# Altium schematic sheet peripherals.SchDoc
size A4
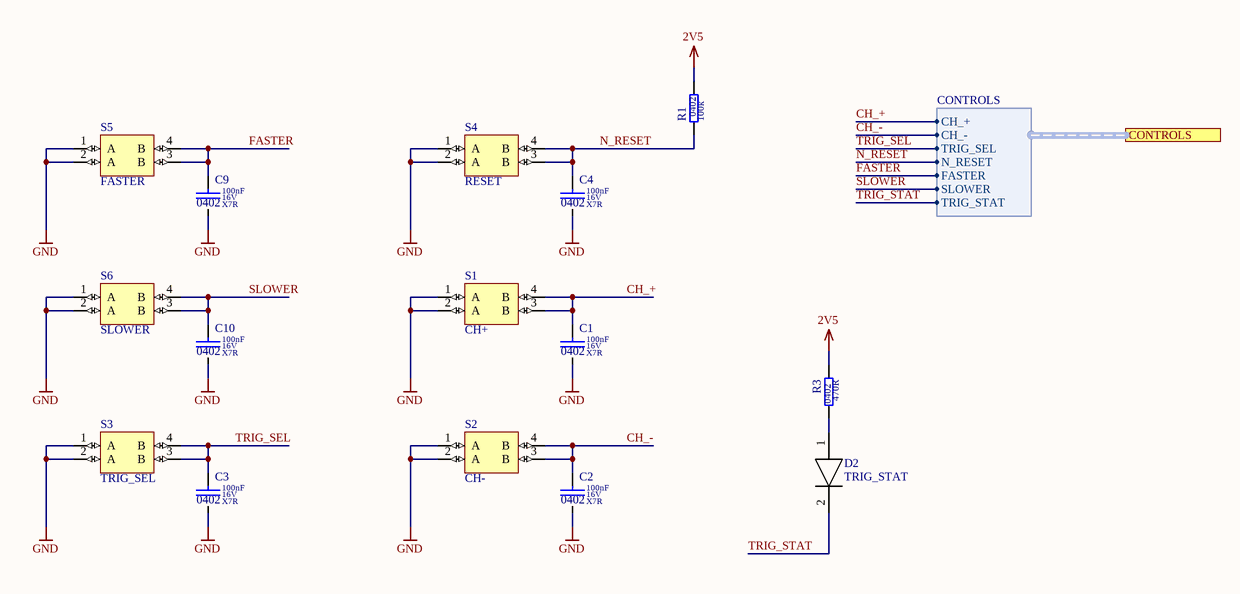
[diagram p0: peripherals.SchDoc]

## Parts
C1  value 100nF  Dielectric: X7R  Voltage: 16V  SCH_Footprint: 0402  [C_0402_1005]  (hidden comment: Ceramic X7R)
C2  value 100nF  Dielectric: X7R  Voltage: 16V  SCH_Footprint: 0402  [C_0402_1005]  (hidden comment: Ceramic X7R)
C3  value 100nF  Dielectric: X7R  Voltage: 16V  SCH_Footprint: 0402  [C_0402_1005]  (hidden comment: Ceramic X7R)
C4  value 100nF  Dielectric: X7R  Voltage: 16V  SCH_Footprint: 0402  [C_0402_1005]  (hidden comment: Ceramic X7R)
C9  value 100nF  Dielectric: X7R  Voltage: 16V  SCH_Footprint: 0402  [C_0402_1005]  (hidden comment: Ceramic X7R)
C10  value 100nF  Dielectric: X7R  Voltage: 16V  SCH_Footprint: 0402  [C_0402_1005]  (hidden comment: Ceramic X7R)
D2  TRIG_STAT  [LED_5mm]
R1  value 100k  SCH_Footprint: 0402  [R_0402_1005]  (hidden comment: Resistor)
R3  value 470R  SCH_Footprint: 0402  [R_0402_1005]  (hidden comment: Resistor)
S1  CH+  [TACT-613N-F]
S2  CH-  [TACT-613N-F]
S3  TRIG_SEL  [TACT-613N-F]
S4  RESET  [TACT-613N-F]
S5  FASTER  [TACT-613N-F]
S6  SLOWER  [TACT-613N-F]

## Ports
CONTROLS (harness CONTROLS)

## Harnesses
CONTROLS: CH_+, CH_-, TRIG_SEL, N_RESET, FASTER, SLOWER, TRIG_STAT

## Nets
2V5: R1.2 R3.1
GND: C1.2 C2.2 C3.2 C4.2 C9.2 C10.2 S1.1(A) S1.2(A) S2.1(A) S2.2(A) S3.1(A) S3.2(A) S4.1(A) S4.2(A) S5.1(A) S5.2(A) S6.1(A) S6.2(A)
CH_+: C1.1 S1.3(B) S1.4(B) ; port CONTROLS.CH_+
CH_-: C2.1 S2.3(B) S2.4(B) ; port CONTROLS.CH_-
FASTER: C9.1 S5.3(B) S5.4(B) ; port CONTROLS.FASTER
N_RESET: C4.1 R1.1 S4.3(B) S4.4(B) ; port CONTROLS.N_RESET
SLOWER: C10.1 S6.3(B) S6.4(B) ; port CONTROLS.SLOWER
TRIG_SEL: C3.1 S3.3(B) S3.4(B) ; port CONTROLS.TRIG_SEL
TRIG_STAT: D2.2(Cathode) ; port CONTROLS.TRIG_STAT
NetD2_1: D2.1(Anode) R3.2

## Library data of the parts
C1-C4 C9 C10 = C_100nF_16V_X7R_0402_10: Capacitor; Manufacturer: Murata; Manufacturer Part Number: GRM155R71C104KA88D; Tolerance (%): 10; Part Number: C_100nF_16V_X7R_0402_10; HelpURL: https://www.mouser.com/ds/2/281/c02e-2905.pdf; Supplier 1: TME; Supplier 2: RS Components; Supplier 3: Farnell; Supplier 4: Mouser; Supplier Part Number 4: 81-GRM155R71C104KA88; Supplier 5: Digi-Key
D2 = LED_5mm: LED_5mm Diameter
R1 = R_100k_0402_1: Manufacturer: Yageo; Manufacturer Part Number: RC0402FR-07100KL; Voltage: 50V; Power: 63mW; Tolerance: 1%; Part Number: R_100k_0402_1; HelpURL: http://www.tme.eu/pl/Document/1a2bc76e2be68b3b1670068306778ce6/rc0402yageo.pdf; Supplier 1: TME; Supplier Part Number 1: RC0402FR-07100K; Supplier 2: RS Components; Supplier 3: Farnell; Supplier Part Number 3: 2131798; Supplier 4: Mouser; Supplier Part Number 4: 603-RC0402FR-07100KL; Supplier 5: Digi-Key; Supplier Part Number 5: 311-100KLRCT-ND
R3 = R_470R_0402_1: Manufacturer: Yageo; Manufacturer Part Number: RC0402FR-07470RL; Voltage: 50V; Power: 63mW; Tolerance: 1%; Part Number: R_470R_0402_1; HelpURL: http://datasheet.octopart.com/RC0402FR-07470RL-Yageo-datasheet-10408619.pdf; Supplier 1: TME; Supplier Part Number 1: RC0402FR-07470R; Supplier 2: RS Components; Supplier 3: Farnell; Supplier Part Number 3: 9239197; Supplier 4: Mouser; Supplier Part Number 4: 603-RC0402FR-07470RL; Supplier 5: Digi-Key; Supplier Part Number 5: 311-470LRCT-ND
S1-S6 = TACT-613N-F